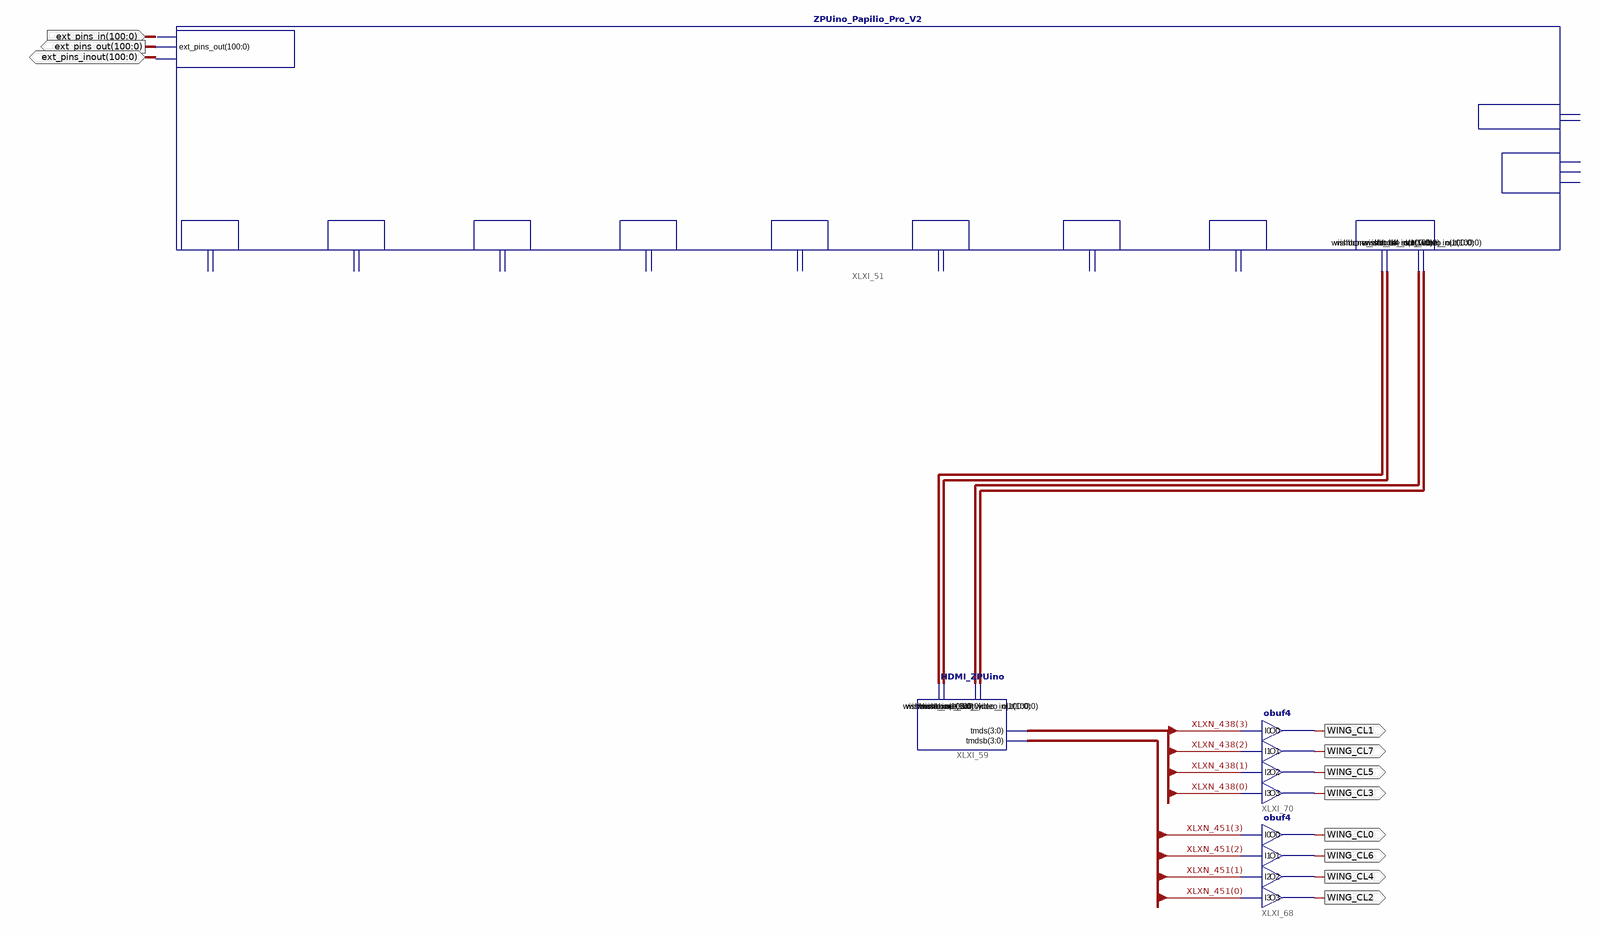
[diagram p0: schematic sheet 1]
// Xilinx ISE schematic Papilio_Pro.sch (spartan6) as structural Verilog: 4 symbols, 11 ports
module Papilio_Pro (
  input  [100:0] ext_pins_in,
  inout  [100:0] ext_pins_inout,
  output [100:0] ext_pins_out,
  output WING_CL1,
  output WING_CL7,
  output WING_CL5,
  output WING_CL3,
  output WING_CL6,
  output WING_CL4,
  output WING_CL2,
  output WING_CL0
);

  wire [3:0] XLXN_438, XLXN_451;
  wire [100:0] XLXN_424, XLXN_425, XLXN_426, XLXN_427;

  ZPUino_Papilio_Pro_V2 XLXI_51 (
    .ext_pins_in(ext_pins_in), .ext_pins_out(ext_pins_out), .ext_pins_inout(ext_pins_inout),
    .wishbone_slot_14_in(XLXN_424), .wishbone_slot_14_out(XLXN_425), .wishbone_slot_video_in(XLXN_426),
    .wishbone_slot_video_out(XLXN_427));  // open: gpio_bus_out, gpio_bus_in, clk_96Mhz, clk_1Mhz, clk_osc_32Mhz, wishbone_slot_5_out, wishbone_slot_5_in, wishbone_slot_6_in, wishbone_slot_6_out, wishbone_slot_8_in, wishbone_slot_8_out, wishbone_slot_9_in, wishbone_slot_9_out, wishbone_slot_10_in, wishbone_slot_10_out, wishbone_slot_11_in, wishbone_slot_11_out, wishbone_slot_12_in, wishbone_slot_12_out, wishbone_slot_13_in, wishbone_slot_13_out
  HDMI_ZPUino XLXI_59 (
    .wishbone_in(XLXN_424), .wishbone_out(XLXN_425), .wishbone_slot_video_in(XLXN_426),
    .wishbone_slot_video_out(XLXN_427), .tmdsb(XLXN_451), .tmds(XLXN_438));
  obuf4 XLXI_68 (
    .I0(XLXN_451[3]), .I1(XLXN_451[2]), .I2(XLXN_451[1]), .I3(XLXN_451[0]), .O0(WING_CL0), .O1(WING_CL6),
    .O2(WING_CL4), .O3(WING_CL2));
  obuf4 XLXI_70 (
    .I0(XLXN_438[3]), .I1(XLXN_438[2]), .I2(XLXN_438[1]), .I3(XLXN_438[0]), .O0(WING_CL1), .O1(WING_CL7),
    .O2(WING_CL5), .O3(WING_CL3));

  // Notes on the sheet:
  //   IOSTANDARD on signal WING_CL1 = TMDS_33
endmodule
